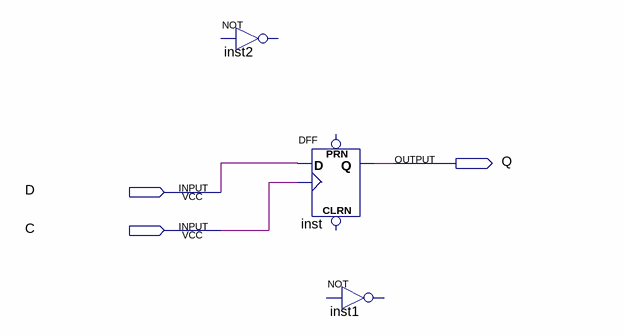
[diagram p0: schematic sheet]
// Quartus schematic d.bdf as structural Verilog: 3 symbols, 3 pins
module d (
  input  D,
  input  C,
  output Q
);

  // NOT inst2 is placed but not wired
  DFF inst (.CLK(C), .D(D), .Q(Q));  // open: CLRN, PRN
  // NOT inst1 is placed but not wired
endmodule
